# EAGLE design hw-demo01 (EAGLE 7.3.0)
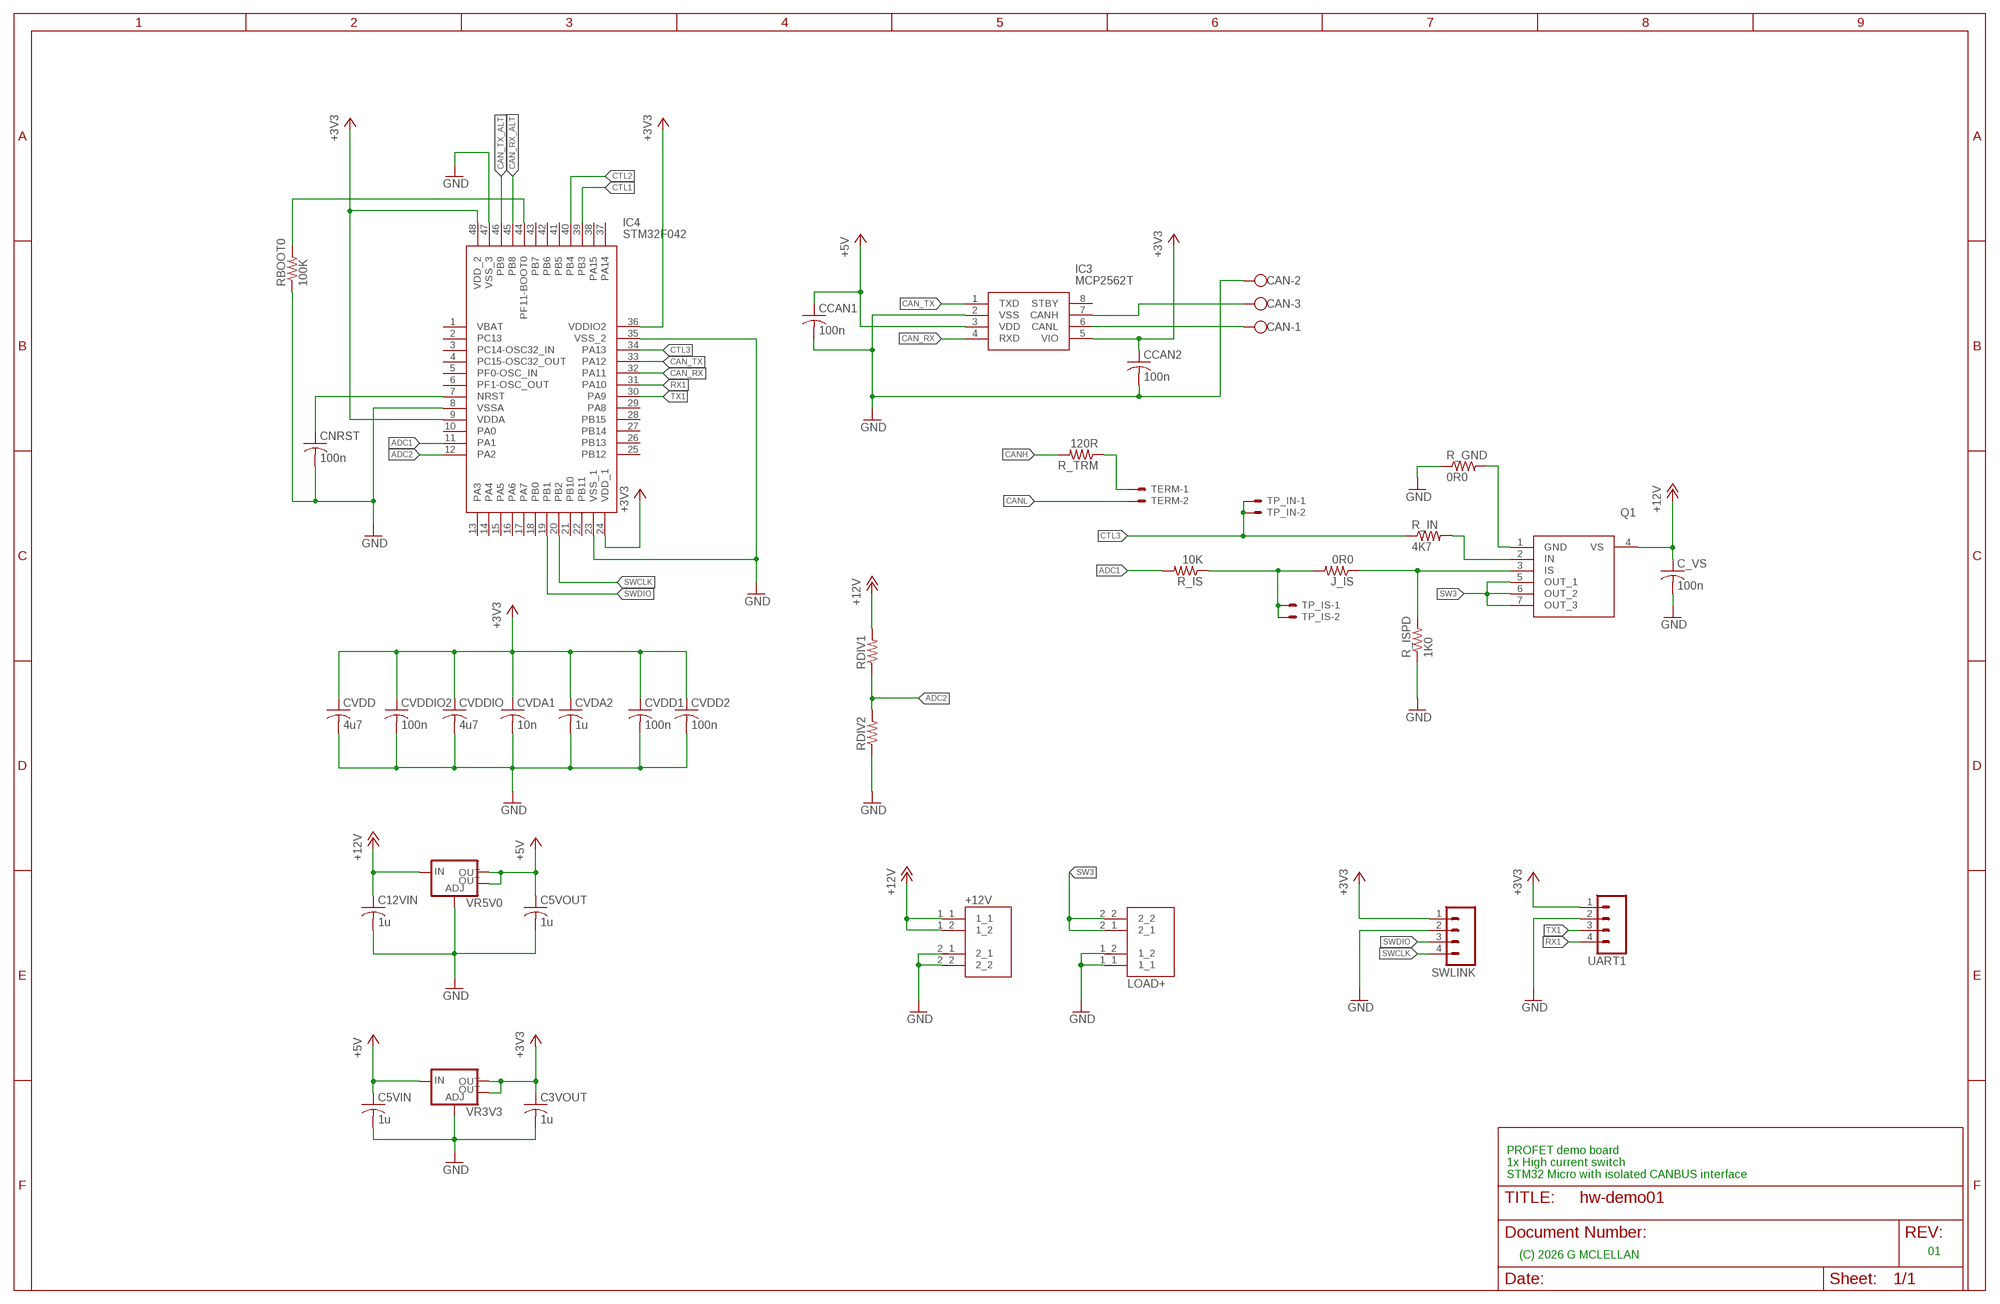
[diagram p0: schematic, sheet 1]

## Parts
+12V  VP0265840000G  [AMPHENOL_VP0265840000G]
C3VOUT  1u  C-USC0805K  [C0805K]
C5VIN  1u  C-USC1206K  [C1206K]
C5VOUT  1u  C-USC0805K  [C0805K]
C12VIN  1u  C-USC1206K  [C1206K]
C_VS  100n  C-USC0603K  [C0603K]
CAN  W237-103  [W237-103]
CCAN1  100n  C-USC0603K  [C0603K]
CCAN2  100n  C-USC0603K  [C0603K]
CNRST  100n  C-USC0603K  [C0603K]
CVDA1  10n  C-USC0603K  [C0603K]
CVDA2  1u  C-USC0603K  [C0603K]
CVDD  4u7  C-USC0603K  [C0603K]
CVDD1  100n  C-USC0603K  [C0603K]
CVDD2  100n  C-USC0603K  [C0603K]
CVDDIO  4u7  C-USC0603K  [C0603K]
CVDDIO2  100n  C-USC0603K  [C0603K]
IC3  MCP2562T  MCP2562T-H_SN  [SOIC127P600X175-8N]
IC4  STM32F042  STM32F042C6T7  [QFP50P900X900X160-48N]
J_IS  0R0  R-US_0207/12  [0207/12]
LOAD+  VP0265840000G  [AMPHENOL_VP0265840000G]
Q1  BTS500101TADATMA2  [BTS500101TADATMA2]
R_GND  0R0  R-US_R1206W  [R1206W]
R_IN  4K7  R-US_0207/12  [0207/12]
R_IS  10K  R-US_0207/12  [0207/12]
R_ISPD  1K0  R-US_0207/12  [0207/12]
R_TRM  120R  R-US_0204/7  [0204/7]
RBOOT0  100K  R-US_R0603  [R0603]
RDIV1  R-US_R0805  [R0805]
RDIV2  R-US_R0805  [R0805]
SWLINK  M04LOCK  [1X04_LOCK]
TERM  22-23-2021  [22-23-2021]
TP_IN  22-23-2021  [22-23-2021]
TP_IS  22-23-2021  [22-23-2021]
UART1  M04LOCK  [1X04_LOCK]
VR3V3  V_REG_LM1117SOT223  [SOT223]
VR5V0  V_REG_LM1117SOT223  [SOT223]

## Nets
+3V3: C3VOUT.1 CCAN2.1 CVDA1.1 CVDA2.1 CVDD1.1 CVDD2.1 CVDD.1 CVDDIO2.1 CVDDIO.1 IC3.5(VIO) IC4.9(VDDA) IC4.24(VDD_1) IC4.36(VDDIO2) IC4.48(VDD_2) SWLINK.1 UART1.1 VR3V3.2(OUT) VR3V3.4(OUT)
+5V: C5VIN.1 C5VOUT.1 CCAN1.1 IC3.3(VDD) VR3V3.3(IN) VR5V0.2(OUT) VR5V0.4(OUT)
+12V: +12V.1_1 +12V.1_2 C12VIN.1 C_VS.1 Q1.4(VS) RDIV1.2 VR5V0.3(IN)
ADC1: IC4.11(PA1) R_IS.2
ADC2: IC4.12(PA2) RDIV1.1 RDIV2.2
BOOT0: IC4.44(PF11-BOOT0) RBOOT0.2
CAN_RX: IC3.4(RXD) IC4.32(PA11)
CAN_RX_ALT: IC4.45(PB8)
CAN_TX: IC3.1(TXD) IC4.33(PA12)
CAN_TX_ALT: IC4.46(PB9)
CANH: CAN.3 IC3.7(CANH) R_TRM.2
CANL: CAN.1 IC3.6(CANL) TERM.2
CTL1: IC4.39(PB3)
CTL2: IC4.40(PB4)
CTL3: IC4.34(PA13) R_IN.1 TP_IN.1 TP_IN.2
CTL3`: Q1.2(IN) R_IN.2
GND: +12V.2_1 +12V.2_2 C3VOUT.2 C5VIN.2 C5VOUT.2 C12VIN.2 C_VS.2 CAN.2 CCAN1.2 CCAN2.2 CNRST.2 CVDA1.2 CVDA2.2 CVDD1.2 CVDD2.2 CVDD.2 CVDDIO2.2 CVDDIO.2 IC3.2(VSS) IC4.8(VSSA) IC4.23(VSS_1) IC4.35(VSS_2) IC4.47(VSS_3) LOAD+.1_1 LOAD+.1_2 R_GND.1 R_ISPD.1 RBOOT0.1 RDIV2.1 SWLINK.2 UART1.2 VR3V3.1(ADJ) VR5V0.1(ADJ)
IS: J_IS.1 Q1.3(IS) R_ISPD.2
N$1: R_TRM.1 TERM.1
N$2: J_IS.2 R_IS.1 TP_IS.1 TP_IS.2
N$3: Q1.1(GND) R_GND.2
N$8: CNRST.1 IC4.7(NRST)
RX1: IC4.31(PA10) UART1.4
SW3: LOAD+.2_1 LOAD+.2_2 Q1.5(OUT_1) Q1.6(OUT_2) Q1.7(OUT_3)
SWCLK: IC4.20(PB2) SWLINK.4
SWDIO: IC4.19(PB1) SWLINK.3
TX1: IC4.30(PA9) UART1.3
Unconnected: IC3.8(STBY) IC4.1(VBAT) IC4.2(PC13) IC4.3(PC14-OSC32_IN) IC4.4(PC15-OSC32_OUT) IC4.5(PF0-OSC_IN) IC4.6(PF1-OSC_OUT) IC4.10(PA0) IC4.13(PA3) IC4.14(PA4) IC4.15(PA5) IC4.16(PA6) IC4.17(PA7) IC4.18(PB0) IC4.21(PB10) IC4.22(PB11) IC4.25(PB12) IC4.26(PB13) IC4.27(PB14) IC4.28(PB15) IC4.29(PA8) IC4.37(PA14) IC4.38(PA15) IC4.41(PB5) IC4.42(PB6) IC4.43(PB7)

## Notes on the sheet
- PROFET demo board
  1x High current switch
  STM32 Micro with isolated CANBUS interface
- 01
- (C) 2026 G MCLELLAN

## Library data of the parts
+12V LOAD+ = VP0265840000G:VP0265840000G; MANUFACTURER: Amphenol Anytek; MAXIMUM_PACKAGE_HEIGHT: 28.5mm; PARTREV: J; STANDARD: Manufacturer Recommendations
C3VOUT C5VIN C5VOUT C12VIN C_VS CCAN1 CCAN2 CNRST CVDA1 CVDA2 CVDD CVDD1 CVDD2 CVDDIO CVDDIO2 = rcl:C-US: CAPACITOR, American symbol
CAN = con-wago-500:W237-103: WAGO SCREW CLAMP; MPN: 237-103; OC_FARNELL: unknown; OC_NEWARK: 18M7116
IC3 = MCP2562T-H_SN:MCP2562T-H_SN: CAN Interface IC Source: Datasheet <https://componentsearchengine.com/Datasheets/1/MCP2562T-H_SN.pdf>; DESCRIPTION: CAN Interface IC; HEIGHT: 1.75mm; MANUFACTURER_NAME: Microchip; MANUFACTURER_PART_NUMBER: MCP2562T-H/SN; MOUSER_PART_NUMBER: 579-MCP2562T-H/SN; MOUSER_PRICE-STOCK: https://www.mouser.co.uk/ProductDetail/Microchip-Technology/MCP2562T-H-SN?qs=eTPcRhULBzwloCb8Xxk0jQ%3D%3D
IC4 = STM32F042C6T7:STM32F042C6T7: Mainstream Arm Cortex-M0 USB line MCU with 32 Kbytes of Flash memory, 48 MHz CPU, USB, CAN and CEC functions Source: Datasheet <https://www.st.com/resource/en/datasheet/stm32f042c4.pdf>; DESCRIPTION: Mainstream Arm Cortex-M0 USB line MCU with 32 Kbytes of Flash memory, 48 MHz CPU, USB, CAN and CEC functions; HEIGHT: 1.6mm; MANUFACTURER_NAME: STMicroelectronics; MANUFACTURER_PART_NUMBER: STM32F042C6T7; MOUSER_PART_NUMBER: 511-STM32F042C6T7; MOUSER_PRICE-STOCK: https://www.mouser.co.uk/ProductDetail/STMicroelectronics/STM32F042C6T7?qs=PqoDHHvF6499eidad5TESA%3D%3D
J_IS R_GND R_IN R_IS R_ISPD R_TRM RBOOT0 RDIV1 RDIV2 = rcl:R-US_: RESISTOR, American symbol
Q1 = BTS500101TADATMA2:BTS500101TADATMA2: Power Switch ICs - Power Distribution MULTICHIP PROFET & GD Source: Datasheet <https://www.infineon.com/assets/row/public/packages/202/footprint_download/infineon-pg-to263-7-10-fpd-pdf-footprint-en.pdf>; DESCRIPTION: Power Switch ICs - Power Distribution MULTICHIP PROFET & GD; HEIGHT: 4.5mm; MANUFACTURER_NAME: Infineon; MANUFACTURER_PART_NUMBER: BTS500101TADATMA2; MOUSER_PART_NUMBER: 726-BTS500101TADATM2; MOUSER_PRICE-STOCK: https://www.mouser.co.uk/ProductDetail/Infineon-Technologies/BTS500101TADATMA2?qs=l7cgNqFNU1huaQviZWv9NQ%3D%3D
SWLINK UART1 = SparkFun-Connectors:M04: Header 4 Standard 4-pin 0.1" header. Use with straight break away headers (SKU : PRT-00116), right angle break away headers (PRT-00553), swiss pins (PRT-00743), machine pins (PRT-00117), and female headers (PRT-00115). Molex polarized connector foot print use with SKU : PRT-08231 with associated crimp pins and housings. 1MM SMD Version SKU: PRT-10208; PROD_ID: CONN-09696
TERM TP_IN TP_IS = con-molex:22-23-2021: .100" (2.54mm) Center Header - 2 Pin; MF: MOLEX; MPN: 22-23-2021; OC_FARNELL: 1462926; OC_NEWARK: 25C3832
VR3V3 VR5V0 = SparkFun-PowerIC:V_REG_LM1117: Voltage Regulator LM1117 Standard adjustable voltage regulator but in SMD form. Spark Fun Electronics SKU : COM-00595; PROD_ID: VREG-08170

## Board
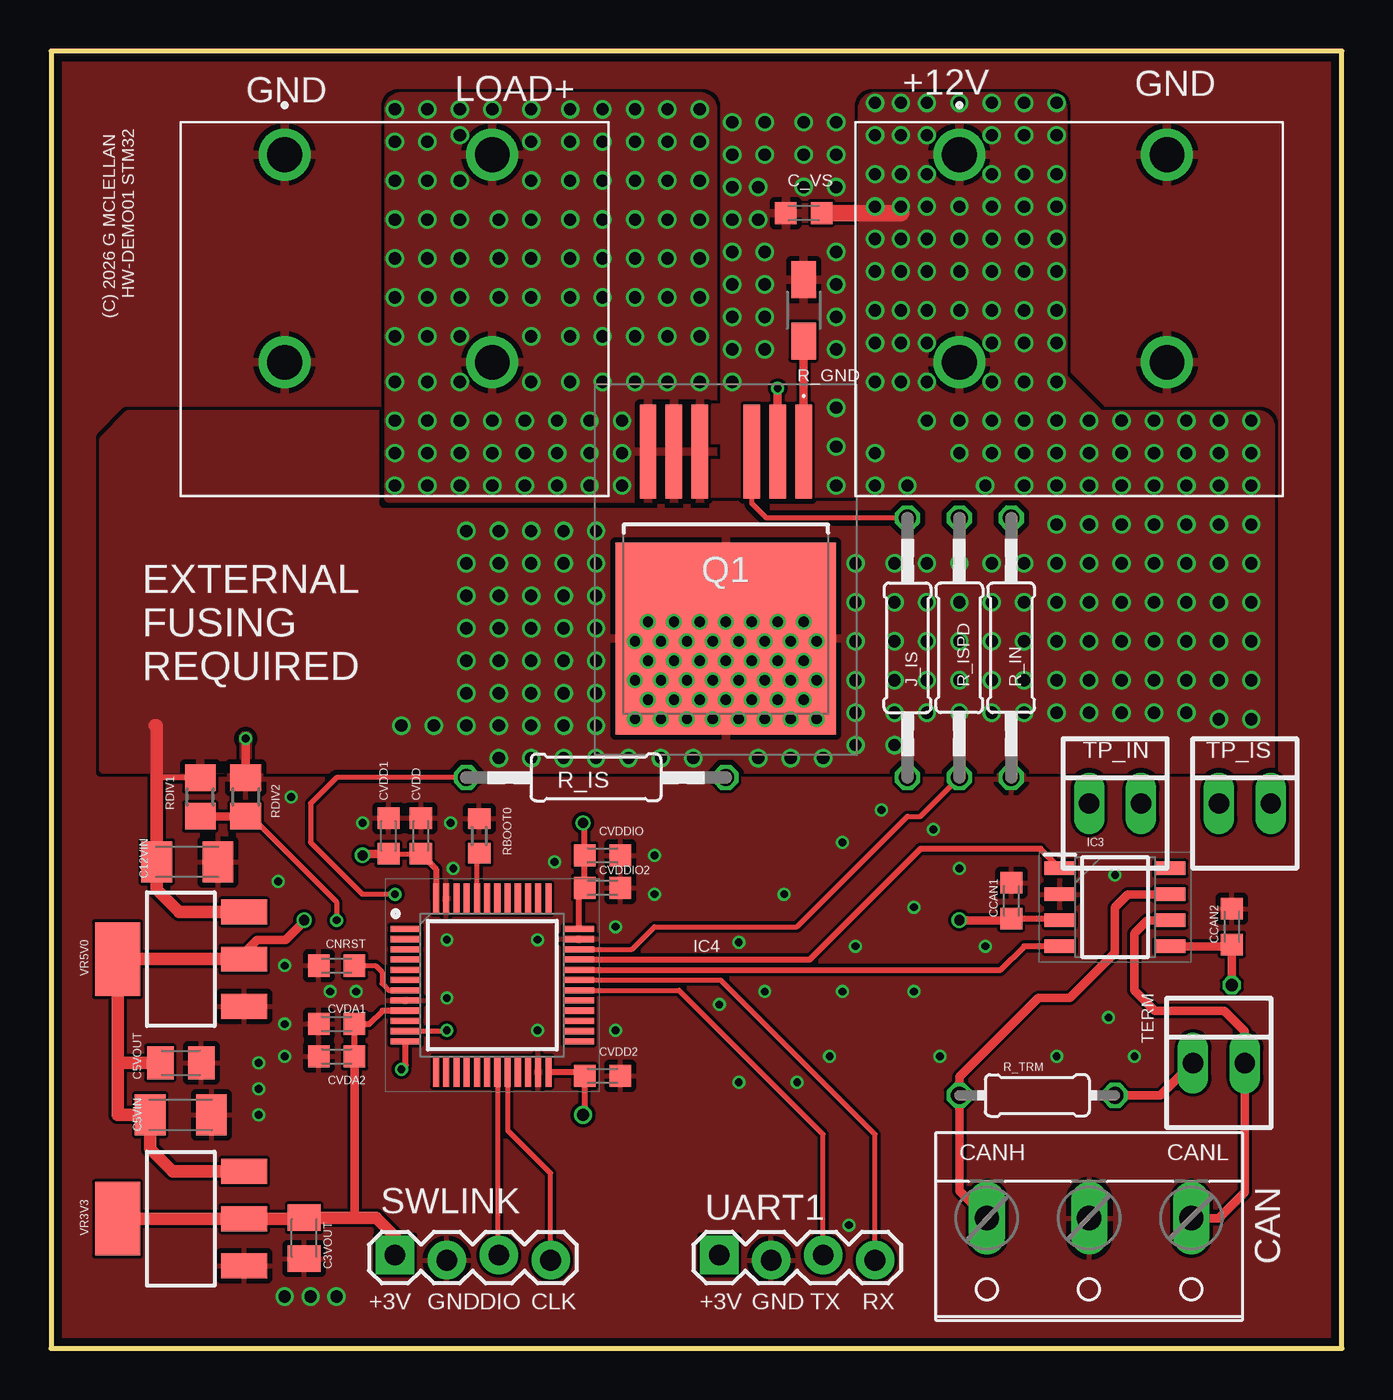
[diagram p1: board, top side]
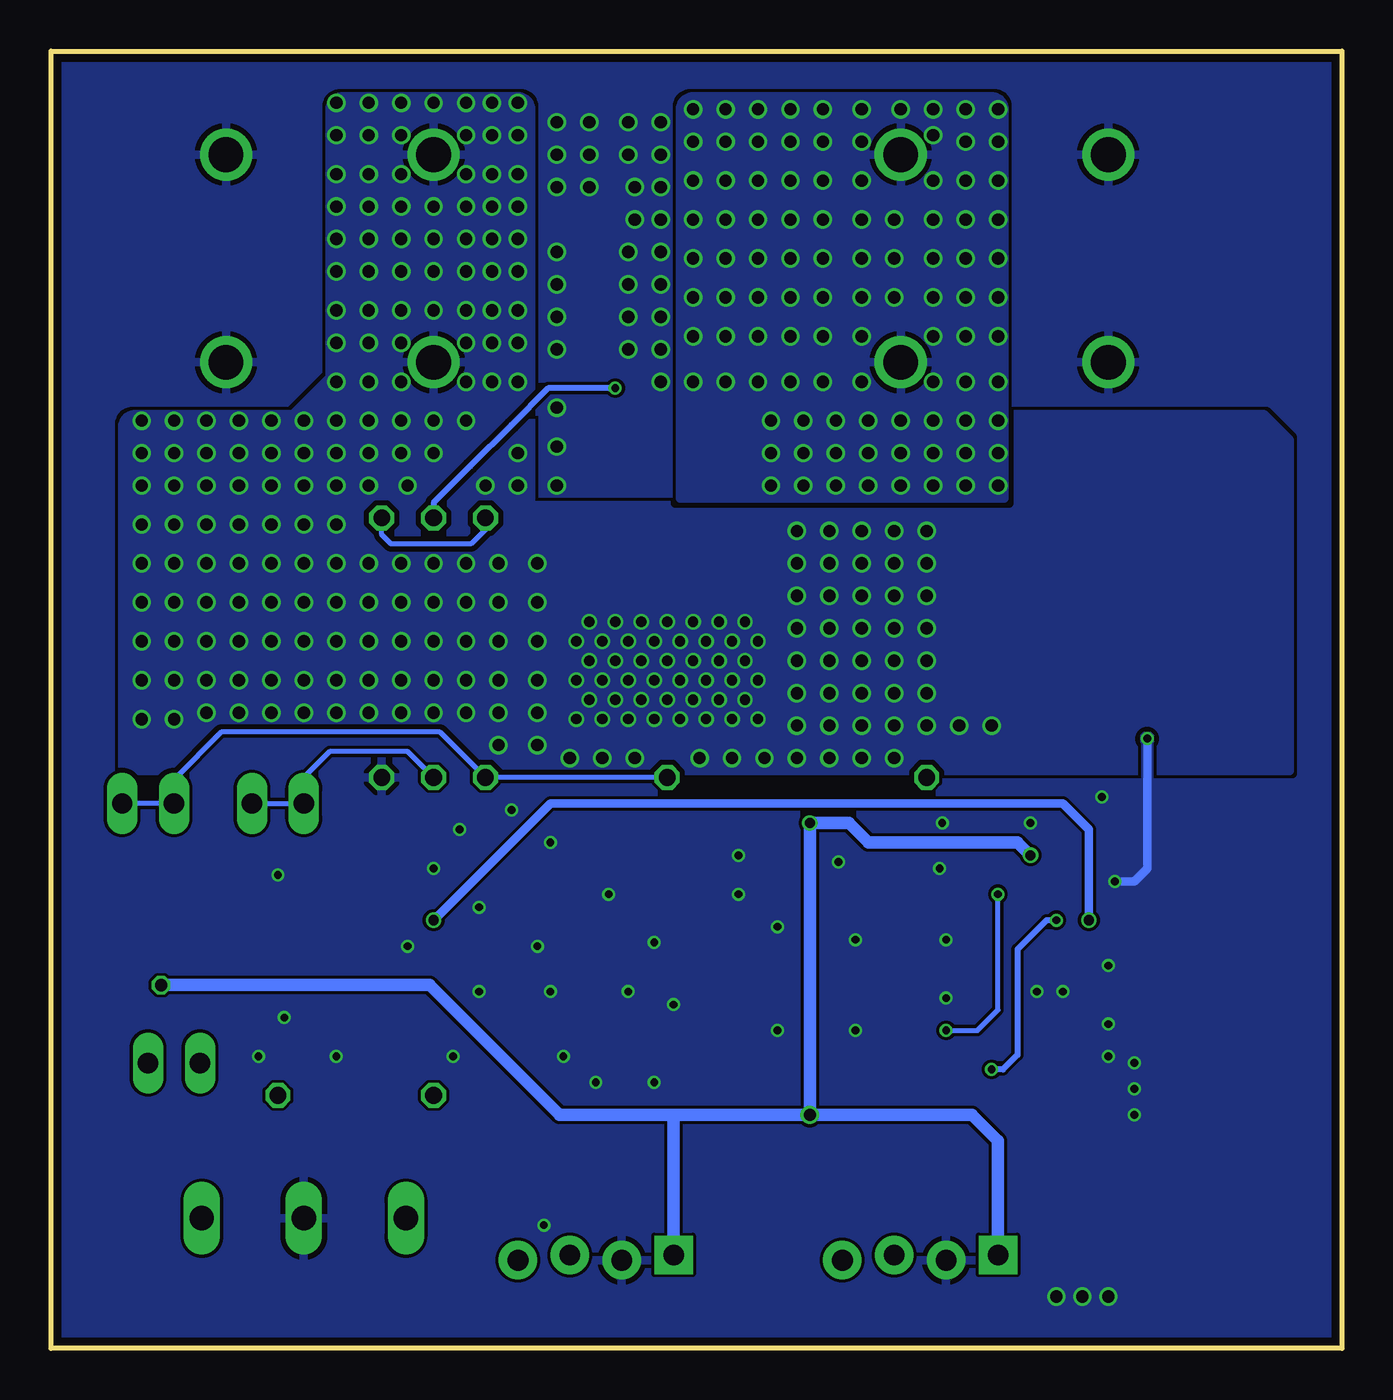
[diagram p2: board, bottom side, seen from below]

Size 63.17 x 63.49 mm. Coordinates in mm from the lower left corner, seen from the top.
Outline: 0,0 63.17,0 63.17,63.49 0,63.49 0,0
Copper layers (1*16): Top 0.035559375mm / dielectric 1.6mm / Bottom 0.035559375mm
Design rules "oshpark-2layer": minimum track width 6mil, minimum drill 10mil, track to track 6mil, track to pad 6mil, pad to pad 6mil, via to via 6mil, smd to smd 6mil, copper to edge 15mil, drill to drill 6mil, minimum pad ring 5mil, minimum via ring 5mil, stop-mask expansion 2.5mil, vias tented up to drill 0mil, thermal gap 10mil

### Footprints (pad centres in the part's own frame; a part is rotated, then mirrored left to right if it is on the bottom)
AMPHENOL_VP0265840000G = drill 1.7: 1_1 -5.08,5.08; 1_2 -5.08,-5.08; 2_1 5.08,5.08; 2_2 5.08,-5.08
C0805K = smd 1.3 x 1.6: 1 -1,0; 2 1,0
C1206K = smd 1.5 x 2: 1 -1.5,0; 2 1.5,0
C0603K = smd 1.05 x 1.08: 1 -0.875,0; 2 0.875,0
W237-103 = drill 1.194 long: 1 -5,-1.29; 2 0,-1.29; 3 5,-1.29
SOIC127P600X175-8N = smd 1.5 x 0.65: 1 -2.7,1.905; 2 -2.7,0.635; 3 -2.7,-0.635; 4 -2.7,-1.905; 5 2.7,-1.905; 6 2.7,-0.635; 7 2.7,0.635; 8 2.7,1.905
QFP50P900X900X160-48N = smd 1.475 x 0.3: 1 -4.238,2.75; 2 -4.238,2.25; 3 -4.238,1.75; 4 -4.238,1.25; 5 -4.238,0.75; 6 -4.238,0.25; 7 -4.238,-0.25; 8 -4.238,-0.75; 9 -4.238,-1.25; 10 -4.238,-1.75; 11 -4.238,-2.25; 12 -4.238,-2.75; 25 4.238,-2.75; 26 4.238,-2.25; 27 4.238,-1.75; 28 4.238,-1.25; 29 4.238,-0.75; 30 4.238,-0.25; 31 4.238,0.25; 32 4.238,0.75; 33 4.238,1.25; 34 4.238,1.75; 35 4.238,2.25; 36 4.238,2.75 | smd 0.3 x 1.475: 13 -2.75,-4.238; 14 -2.25,-4.238; 15 -1.75,-4.238; 16 -1.25,-4.238; 17 -0.75,-4.238; 18 -0.25,-4.238; 19 0.25,-4.238; 20 0.75,-4.238; 21 1.25,-4.238; 22 1.75,-4.238; 23 2.25,-4.238; 24 2.75,-4.238; 37 2.75,4.238; 38 2.25,4.238; 39 1.75,4.238; 40 1.25,4.238; 41 0.75,4.238; 42 0.25,4.238; 43 -0.25,4.238; 44 -0.75,4.238; 45 -1.25,4.238; 46 -1.75,4.238; 47 -2.25,4.238; 48 -2.75,4.238
0207/12 = drill 0.813 octagon: 1 -6.35,0; 2 6.35,0
BTS500101TADATMA2 = smd 0.8 x 4.6: 1 -3.81,-6.425; 2 -2.54,-6.425; 3 -1.27,-6.425; 5 1.27,-6.425; 6 2.54,-6.425; 7 3.81,-6.425 | smd 10.8 x 9.4: 4 0,2.725
R1206W = smd 1.8 x 1.2: 1 -1.499,0; 2 1.499,0
0204/7 = drill 0.813 octagon: 1 -3.81,0; 2 3.81,0
R0603 = smd 1 x 1.1: 1 -0.85,0; 2 0.85,0
R0805 = smd 1.3 x 1.5: 1 -0.95,0; 2 0.95,0
1X04_LOCK = drill 1.016 pad 1.88 square: 1 0,0.127 | drill 1.016 pad 1.88: 2 2.54,-0.127; 3 5.08,0.127; 4 7.62,-0.127
22-23-2021 = drill 1 long: 1 -1.27,0; 2 1.27,0
SOT223 = smd 1.219 x 2.235: 1 -2.311,-3.099; 2 0,-3.099; 3 2.311,-3.099 | smd 3.6 x 2.2: 4 0,3.099

### Placement (x,y rotation side)
+12V  49.53,53.34 0 top
C3VOUT  12.38,5.4 270 top
C5VIN  6.35,11.43 0 top
C5VOUT  6.35,13.97 0 top
C12VIN  6.67,23.81 0 top
C_VS  36.83,55.56 180 top
CAN  50.8,5.08 180 top
CCAN1  46.99,21.91 90 top
CCAN2  57.78,20.64 90 top
CNRST  13.97,18.73 180 top
CVDA1  13.97,15.88 180 top
CVDA2  13.97,14.29 180 top
CVDD  18.1,25.08 90 top
CVDD1  16.51,25.08 90 top
CVDD2  26.99,13.34 0 top
CVDDIO  26.99,24.13 0 top
CVDDIO2  26.99,22.54 0 top
IC3  52.07,21.59 0 top
IC4  21.59,17.78 0 top
J_IS  41.91,34.29 270 top
LOAD+  16.51,53.34 0 top
Q1  33.02,37.47 180 top
R_GND  36.83,50.8 270 top
R_IN  44.45,34.29 90 top
R_IS  26.67,27.94 180 top
R_ISPD  46.99,34.29 90 top
R_TRM  48.26,12.38 180 top
RBOOT0  20.96,25.08 270 top
RDIV1  7.3,26.99 90 top
RDIV2  9.53,26.99 270 top
SWLINK  16.83,4.45 0 top
TERM  57.15,13.97 0 top
TP_IN  52.07,26.67 0 top
TP_IS  58.42,26.67 0 top
UART1  32.7,4.45 0 top
VR3V3  6.35,6.35 90 top
VR5V0  6.35,19.05 90 top

### Tracks (layer width: path | path; a pad name or v marks a point on that pad's centre or on a via)
+3V3  (via drill 0.5, 0.6)
  Top 0.254: CVDD1.1 CVDD.1
  Top 0.305: IC4.24 25.91,13.54 CVDD2.1 26.11,11.51 v26.04,11.43 | IC4.36 25.83,22.26 CVDDIO2.1 CVDDIO.1 26.11,25.64 v26.04,25.72 | IC4.9 16.21,16.53 15.56,15.88 CVDA1.1 CVDA2.1 | CVDD.1 18.84,23.46 IC4.48
  Top 0.406: CVDD2.1 26.04,13.34 | v57.78,17.78 CCAN2.1 57.71,19.68 IC3.5 | 9.45,6.27 VR3V3.2 | CVDA2.1 14.84,6.4 15.24,6.4 | CVDD1.1 15.24,24.21 v15.24,24.13
  Top 0.61: VR3V3.4 VR3V3.2 12.38,6.35 C3VOUT.1 15.24,6.4 15.89,6.4 16.83,5.46 SWLINK.1
  Bottom 0.61: 32.7,11.43 38.29,11.43 44.64,17.78 v57.78,17.78 | v26.04,11.43 18.1,11.43 16.83,10.16 SWLINK.1 | v26.04,11.43 32.7,11.43 | v26.04,11.43 v26.04,25.72 24.13,25.72 23.18,24.77 15.88,24.77 v15.24,24.13 | UART1.1 32.7,11.43
+5V  (via drill 0.5)
  Top 0.305: CCAN1.1 49.29,21.03 IC3.3
  Top 0.406: CCAN1.1 46.99,20.95 v44.45,20.95 | VR5V0.2 9.45,19.36 10.09,20 11.48,20 12.38,20.9 v12.38,20.95
  Top 0.61: 3.25,13.97 3.25,11.43 C5VIN.1 4.85,9.76 5.94,8.66 VR3V3.3 | 3.25,13.97 VR5V0.4 VR5V0.2 | C5VOUT.1 3.25,13.97
  Bottom 0.406: v44.45,20.95 38.73,26.67 13.65,26.67 12.38,25.4 v12.38,20.95
+12V  (via drill 0.5, 0.6)
  Top 0.305: RDIV1.2 5.17,27.94
  Top 0.61: VR5V0.3 6.26,21.36 5.17,22.45 C12VIN.1 5.17,27.94 5.17,30.48 5.08,30.48
  Top 0.813: C_VS.1 41.59,55.56 v41.59,55.88
  other vias: 28.57,30.8 29.21,31.75 29.84,30.8 30.48,31.75 31.11,30.8 31.75,31.75 32.38,30.8 33.02,31.75 33.65,30.8 34.29,31.75 34.92,30.8 35.56,31.75 36.2,30.8 36.83,31.75 37.46,30.8 28.57,32.7 29.84,32.7 31.11,32.7 32.38,32.7 33.65,32.7 34.92,32.7 36.2,32.7 37.46,32.7 29.21,33.66 30.48,33.66 31.75,33.66 33.02,33.66 34.29,33.66 35.56,33.66 36.83,33.66 28.57,34.61 29.21,35.56 29.84,34.61 30.48,35.56 31.11,34.61 31.75,35.56 32.38,34.61 33.02,35.56 33.65,34.61 34.92,34.61 36.2,34.61 34.29,35.56 35.56,35.56 36.83,35.56 37.46,34.61 47.62,49.21 49.21,49.21 46.04,47.31 46.04,49.21 49.21,50.8 47.62,50.8 46.04,50.8 44.45,50.8 44.45,31.11 39.37,31.11 47.62,32.7 47.62,31.11 44.45,34.61 39.37,32.7 39.37,34.61 44.45,36.51 42.86,36.51 47.62,36.51 39.37,36.51 39.37,38.42 46.04,38.42 44.45,38.42 46.04,31.11 46.04,34.61 47.62,34.61 42.86,34.61 46.04,36.51 42.86,38.42 47.62,38.42 26.67,30.48 25.08,30.48 23.5,30.48 23.5,32.07 25.08,32.07 26.67,32.07 26.67,33.66 25.08,33.66 23.5,33.66 23.5,35.24 25.08,35.24 26.67,35.24 26.67,38.42 25.08,36.83 23.5,36.83 23.5,38.42 25.08,38.42 26.67,36.83 26.67,40.01 25.08,40.01 23.5,40.01 40.32,59.37 40.32,60.96 41.59,60.96 49.21,59.37 47.62,59.37 46.04,57.47 46.04,59.37 40.32,57.47 41.59,59.37 42.86,57.47 42.86,59.37 42.86,50.8 41.59,50.8 42.86,49.21 42.86,47.31 41.59,47.31 40.32,47.31 41.59,49.21 40.32,49.21 42.86,60.96 44.45,60.96 46.04,60.96 47.62,60.96 49.21,60.96 41.59,57.47 47.62,57.47 49.21,57.47 49.21,55.88 47.62,55.88 46.04,55.88 44.45,55.88 42.86,55.88 49.21,54.29 47.62,54.29 46.04,54.29 44.45,54.29 42.86,54.29 41.59,54.29 40.32,54.29 40.32,52.7 41.59,52.7 42.86,52.7 44.45,52.7 46.04,52.7 47.62,52.7 49.21,52.7 40.32,50.8 47.62,47.31 49.21,47.31 42.86,45.4 46.04,45.4 44.45,45.4 47.62,45.4 49.21,45.4 50.8,45.4 44.45,43.81 46.04,43.81 47.62,43.81 49.21,43.81 50.8,43.81 52.39,43.81 53.97,43.81 55.56,43.81 57.15,43.81 58.74,43.81 58.74,45.4 52.39,45.4 53.97,45.4 55.56,45.4 57.15,45.4 40.32,55.88 40.32,43.81 40.32,42.23 41.91,42.23 45.72,42.23 47.62,42.23 49.21,42.23 50.8,42.23 52.39,42.23 53.97,42.23 55.56,42.23 57.15,42.23 58.74,42.23 58.74,40.32 58.74,38.42 58.74,36.51 58.74,34.61 58.74,32.7 57.15,40.32 55.56,40.32 53.97,40.32 52.39,40.32 50.8,40.32 49.21,40.32 57.15,38.42 55.56,38.42 53.97,38.42 52.39,38.42 50.8,38.42 49.21,38.42 57.15,36.51 55.56,36.51 53.97,36.51 52.39,36.51 50.8,36.51 49.21,36.51 57.15,34.61 55.56,34.61 53.97,34.61 52.39,34.61 50.8,34.61 49.21,34.61 57.15,32.7 55.56,32.7 53.97,32.7 52.39,32.7 50.8,32.7 49.21,32.7 58.74,30.8 57.15,30.8 55.56,31.11 53.97,31.11 52.39,31.11 50.8,31.11 49.21,31.11 41.27,38.42 41.27,36.51 41.27,34.61 46.04,32.7 44.45,32.7 42.86,32.7 41.27,32.7 42.86,31.11 41.27,31.11 41.27,29.53 39.37,29.53 37.78,28.89 37.78,28.89 36.2,28.89 34.61,28.89 31.43,28.89 29.84,28.89 28.26,28.89 26.67,28.89 25.08,28.89 23.5,28.89 21.91,28.89 21.91,30.48 21.91,32.07 21.91,33.66 21.91,35.24 21.91,36.83 21.91,38.42 21.91,40.01 20.32,40.01 20.32,38.42 20.32,36.83 20.32,35.24 20.32,33.66 20.32,32.07 20.32,30.48 18.73,30.48 17.14,30.48
  pour Top (isolate 0.254, rank 4): 40.32,61.28 48.89,61.28 arc-90 49.53,60.64 49.53,47.52 51.33,45.72 59.05,45.72 arc-90 59.69,45.09 59.69,28.32 2.54,28.32 2.54,44.45 3.81,45.72 16.51,45.72 16.51,41.27 39.69,41.27 39.69,60.64 arc-90
  pour Bottom (isolate 0.254, rank 4): 59.69,28.26 59.69,45.09 arc90 59.05,45.72 51.33,45.72 49.53,47.52 49.53,60.64 arc90 48.89,61.28 40.32,61.28 arc90 39.69,60.64 39.69,41.27 16.51,41.27 16.51,45.72 3.81,45.72 2.54,44.45 2.54,28.26
ADC1  (via drill 0.38)
  Top 0.254: IC4.11 19.37,15.53 v19.37,15.56 | R_IS.2 13.97,27.94 12.7,26.67 12.7,24.77 15.24,22.23 v16.83,22.23
  Bottom 0.254: v19.37,15.56 17.83,15.56 16.83,16.56 v16.83,22.23
ADC2  (via drill 0.38)
  Top 0.254: RDIV2.2 9.79,26.04 13.97,21.86 v13.97,20.95
  Top 0.305: v17.14,13.65 17.35,13.86 IC4.12
  Top 0.406: RDIV1.1 RDIV2.2
  Bottom 0.305: v13.97,20.95 14.46,20.95 15.88,19.54 15.88,14.36 16.59,13.65 v17.14,13.65
BOOT0
  Top 0.254: IC4.44 20.84,24.12 RBOOT0.2
CAN_RX
  Top 0.305: IC4.32 46.47,18.53 47.62,19.68 IC3.4
CAN_TX
  Top 0.305: IC4.33 37.13,19.03 42.54,24.45 48.42,24.45 IC3.1
CANH
  Top 0.406: IC3.7 52.7,22.23 52.07,21.59 52.07,19.37 49.85,17.14 48.31,17.14 44.45,13.28 R_TRM.2 44.45,7.72 CAN.3
CANL
  Top 0.406: IC3.6 53.66,20.95 53.02,20.32 53.02,17.51 54.03,16.51 57.42,16.51 58.42,15.51 TERM.2 58.42,7.64 57.15,6.37 CAN.1
CTL3
  Top 0.254: IC4.34 28.42,19.53 29.53,20.64 36.51,20.64 41.91,26.04 42.54,26.04 R_IN.1
  Bottom 0.254: TP_IN.2 TP_IN.1 50.8,27.94 49.53,29.21 45.72,29.21 R_IN.1
CTL3`  (via drill 0.38)
  Top 0.406: v35.56,46.99 Q1.2
  Bottom 0.305: R_IN.2 44.45,41.38 42.65,43.18 40.64,45.19 38.84,46.99 v35.56,46.99
GND  (via drill 0.38, 0.6)
  Top 0.406: RDIV2.1 v9.53,29.84
  Bottom 0.406: v11.11,22.86 10.16,22.86 9.53,23.5 v9.53,29.84
  other vias: 24.64,23.81 29.53,22.23 29.53,24.13 33.65,13.02 27.62,15.56 44.45,23.5 15.24,25.72 32.7,16.83 34.92,17.46 52.07,23.18 42.23,17.46 38.73,17.46 39.37,19.68 42.23,21.59 45.72,19.68 43.18,25.4 43.5,14.29 38.73,24.77 35.88,22.23 36.51,13.02 39.05,6.03 38.1,14.29 49.21,14.29 38.42,52.07 38.42,53.66 53.02,14.29 51.75,16.19 19.56,25.72 19.37,20 23.81,20 19.37,17.14 23.81,15.56 11.43,2.54 12.7,2.54 13.97,2.54 33.65,19.88 40.64,26.35 11.75,26.99 19.68,23.5 10.16,11.43 10.16,12.7 10.16,13.97 11.43,14.29 11.43,15.88 11.43,18.73 13.65,17.46 14.92,17.46 27.62,20.64 34.61,55.24 33.34,56.83 34.92,53.66 34.92,52.07 38.42,42.23 38.42,44.13 38.42,46.04 33.34,47.31 33.34,48.9 33.34,50.48 33.34,52.07 33.34,53.66 33.34,55.24 34.61,56.83 33.34,58.42 34.92,58.42 34.92,60.01 33.34,60.01 38.42,56.83 38.42,58.42 38.42,60.01 36.83,60.01 36.83,58.42 36.83,56.83 34.92,50.48 34.92,48.9 38.42,48.9 38.42,50.48
  pour Bottom (rank 6): 0,63.5 63.18,63.5 63.18,0 0,0
  pour Top (rank 6): 0,63.5 63.18,63.5 63.18,27.94 0,27.94
  pour Top (rank 5): 0,29.21 63.18,29.21 63.18,0.32 0,0.32
IS
  Top 0.254: J_IS.1 35,40.64 34.29,41.35 Q1.3
  Bottom 0.254: J_IS.1 41.91,40.08 42.62,39.37 46.54,39.37 46.99,39.82 R_ISPD.2
N$1
  Top 0.406: R_TRM.1 54.29,12.38 TERM.1
N$2
  Bottom 0.254: R_IS.1 J_IS.2 44.13,30.16 54.84,30.16 57.15,27.85 TP_IS.1 TP_IS.2
N$3
  Top 0.406: Q1.1 R_GND.2
N$8
  Top 0.254: IC4.7 16.52,17.53 16.19,17.86 16.19,18.41 15.88,18.73 CNRST.1
RX1
  Top 0.254: IC4.31 32.77,18.03 40.32,10.48 UART1.4
SW3  (via drill 0.6)
  other vias: 23.5,47.31 20,49.53 23.5,49.53 31.75,47.31 25.4,49.53 18.41,47.31 20,47.31 25.4,51.44 23.5,51.44 21.91,51.44 20,51.44 25.4,47.31 23.5,57.15 25.4,57.15 23.5,59.05 25.4,59.05 20,55.24 23.5,55.24 25.4,55.24 16.83,49.53 18.41,49.53 16.83,51.44 16.83,53.34 18.41,51.44 20,57.15 20,59.37 18.41,59.05 16.83,59.05 30.16,47.31 28.57,47.31 26.99,47.31 31.75,49.53 30.16,49.53 28.57,49.53 26.99,49.53 26.99,51.44 28.57,51.44 30.16,51.44 31.75,51.44 31.75,53.34 31.75,55.24 31.75,57.15 31.75,59.05 30.16,53.34 30.16,55.24 30.16,57.15 30.16,59.05 28.57,53.34 28.57,55.24 28.57,57.15 28.57,59.05 26.99,53.34 26.99,55.24 26.99,57.15 26.99,59.05 16.83,47.31 27.94,45.4 27.94,43.81 18.41,57.15 16.83,57.15 18.41,55.24 16.83,55.24 21.91,55.24 25.4,53.34 23.5,53.34 21.91,53.34 20,53.34 18.41,53.34 27.94,42.23 26.35,45.4 24.77,45.4 23.18,45.4 21.59,45.4 20,45.4 18.41,45.4 16.83,45.4 26.35,43.81 24.77,43.81 23.18,43.81 21.59,43.81 20,43.81 18.41,43.81 16.83,43.81 26.35,42.23 24.77,42.23 23.18,42.23 21.59,42.23 20,42.23 18.41,42.23 16.83,42.23 16.83,60.64 18.41,60.64 20,60.64 21.59,60.64 23.5,60.64 25.4,60.64 26.99,60.64 28.57,60.64 30.16,60.64 31.75,60.64
  pour Top (rank 3): 16.51,41.59 16.51,60.64 arc-90 17.14,61.28 31.75,61.28 arc-90 32.38,60.64 32.38,41.59
  pour Bottom (rank 3): 16.51,41.59 16.51,60.64 arc-90 17.14,61.28 31.75,61.28 arc-90 32.38,60.64 32.38,41.59
SWCLK
  Top 0.254: IC4.20 22.34,10.68 24.45,8.57 SWLINK.4
SWDIO
  Top 0.254: IC4.19 21.84,4.64 SWLINK.3
TX1
  Top 0.254: IC4.30 30.73,17.53 37.78,10.48 UART1.3

### Text on the board
tNames: GND | GND | (C) 2026 G MCLELLAN / HW-DEMO01 STM32 | EXTERNAL / FUSING / REQUIRED | CANH | CANL | +3V | GND | DIO | CLK | +3V | GND | TX | RX